# EAGLE design ctrlm_v1a (EAGLE 5.10)
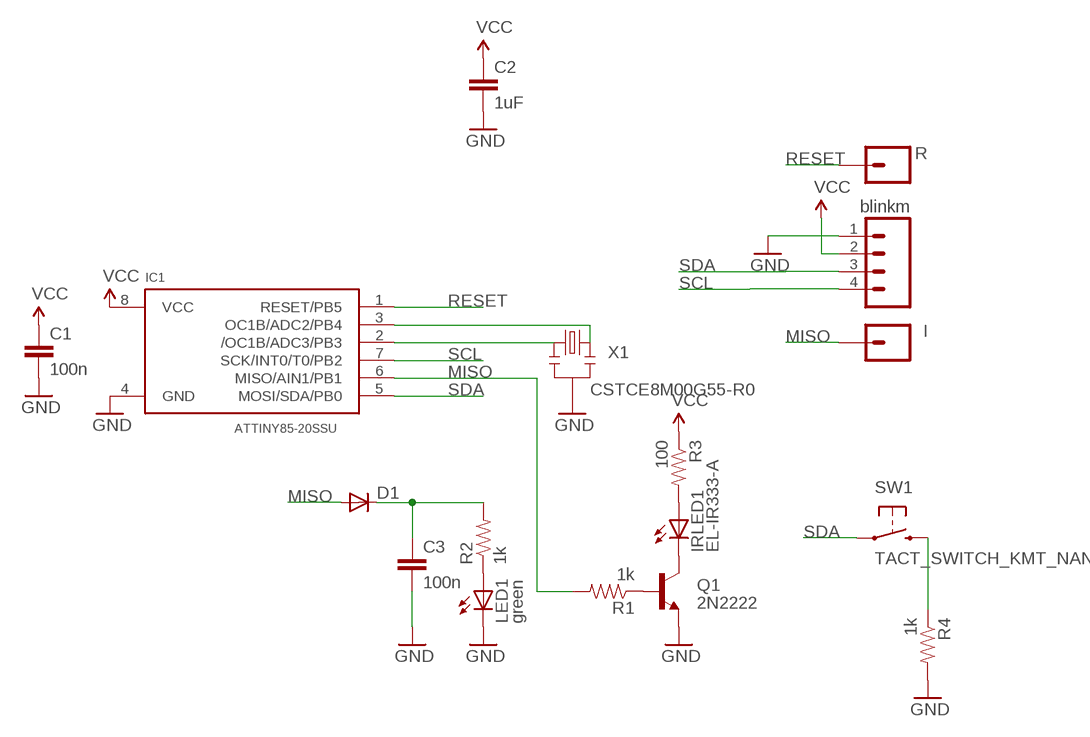
[diagram p0: schematic, sheet 1]

## Parts
C1  100n  CAP0603-CAP  [0603-CAP]
C2  1uF  CAP0805  [0805]
C3  100n  CAP0603-CAP  [0603-CAP]
D1  DIODESOD  [SOD-323]
I  M01PTH  [1X01]
IC1  ATTINY85-20SSU  ATTINY45SOIC  [SO08-EIAJ]
IRLED1  EL-IR333-A  LED5MM  [LED5MM]
JP1  blinkm  M04LOCK  [1X04_LOCK]
LED1  green  LED0603  [LED-0603]
Q1  2N2222  TRANSISTOR_NPNSOT23-3  [SOT23-3]
R  M01PTH  [1X01]
R1  1k  RESISTOR0603-RES  [0603-RES]
R2  1k  RESISTOR0603-RES  [0603-RES]
R3  100  RESISTOR0603-RES  [0603-RES]
R4  1k  RESISTOR0603-RES  [0603-RES]
SW1  TACT_SWITCH_KMT_NANO  [TACT_SWITCH_KMT_NANO]
X1  CSTCE8M00G55-R0  RESONATORSMD  [RESONATOR-SMD]

## Nets
GND: C1.2 C2.2 C3.2 IC1.4(GND) JP1.1 LED1.C Q1.2(E) R4.2 X1.2
MISO: D1.2(A) I.1 IC1.6(MISO/AIN1/PB1) R1.2
N$1: LED1.A R2.1
N$2: Q1.1(B) R1.1
N$3: IRLED1.K(C) Q1.3(C)
N$4: IC1.2(/OC1B/ADC3/PB3) X1.1
N$5: IC1.3(OC1B/ADC2/PB4) X1.3
N$6: C3.1 D1.1(C) R2.2
N$7: IRLED1.A R3.2
N$8: R4.1 SW1.P2@1
RESET: IC1.1(RESET/PB5) R.1
SCL: IC1.7(SCK/INT0/T0/PB2) JP1.4
SDA: IC1.5(MOSI/SDA/PB0) JP1.3 SW1.P1@1
VCC: C1.1 C2.1 IC1.8(VCC) JP1.2 R3.1

## Library data of the parts
C1-C3 = SparkFun-20091103:CAP: Capacitor Standard 0603 ceramic capacitor, and 0.1" leaded capacitor.
D1 = SparkFun-20091103:DIODE: Diode These are standard reverse protection diodes and small signal diodes. SMA package can handle up to about 1A. SOD-323 can handle about 200mA. What the SOD-323 package when ordering, there are some mfgs out there that are 5-pin packages.
I R = SparkFun-20091103:M01: Header 1 Standard 1-pin 0.1" header. Use with straight break away headers (SKU : PRT-00116), right angle break away headers (PRT-00553), swiss pins (PRT-00743), machine pins (PRT-00117), and female headers (PRT-00115).
IC1 = todstuff:ATTINY45
IRLED1 LED1 = SparkFun-20091103:LED: LEDs Standard schematic elements and footprints for 5mm, 3mm, 1206, and 0603 sized LEDs. 5mm - Spark Fun Electronics SKU : COM-00529 (and others)
JP1 = SparkFun-20091103:M04: Header 4 Standard 4-pin 0.1" header. Use with straight break away headers (SKU : PRT-00116), right angle break away headers (PRT-00553), swiss pins (PRT-00743), machine pins (PRT-00117), and female headers (PRT-00115). Molex polarized connector foot print use with SKU : PRT-08231 with associated crimp pins and housings.
Q1 = SparkFun-20091103:TRANSISTOR_NPN: Transistor NPN BJT configuration in SOT23 package. MMBT2222 is the common NPN we use. Double check BCE configuration again layout.
R1-R4 = SparkFun-20091103:RESISTOR: Resistor Basic schematic elements and footprints for 0603, 1206, and PTH 1/10th watt (small) resistors.
SW1 = todstuff:TACT_SWITCH_KMT_NANO
X1 = SparkFun-20090330:RESONATOR: Resonator Small SMD resonator. This is the itty bitty 10/20MHz resonators with built in caps. CSTCE10M0G55 and CSTCE20M0V53. Footprint has been reviewed closely but hasn't been tested yet.

## Board
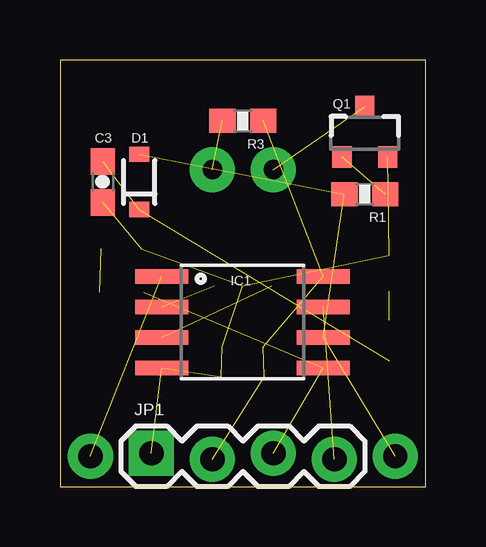
[diagram p1: board, top side]
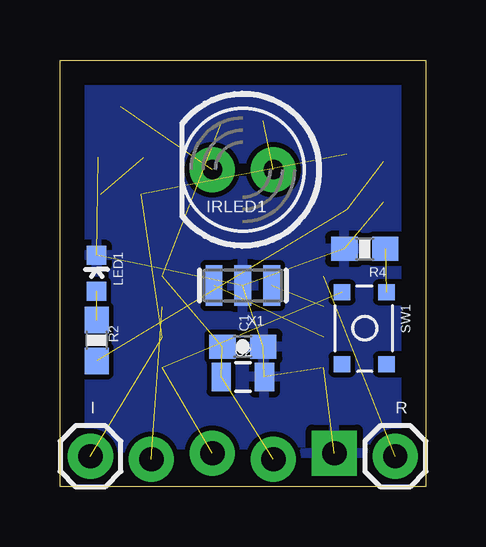
[diagram p2: board, bottom side, seen from below]

Size 15.24 x 17.78 mm. Coordinates in mm from the lower left corner, seen from the top.
Outline: 0,17.78 0,0 15.24,0 15.24,17.78 0,17.78
Copper layers (1*16): Top 0.035mm / dielectric 1.5mm / Bottom 0.035mm
Design rules "default": minimum track width 10mil, minimum drill 24mil, track to track 8mil, track to pad 8mil, pad to pad 8mil, via to via 8mil, smd to smd 8mil, copper to edge 40mil, drill to drill 8mil, minimum pad ring 10mil, minimum via ring 8mil, stop-mask expansion 4mil, vias tented up to drill 0mil, thermal gap 10mil

### Footprints (pad centres in the part's own frame; a part is rotated, then mirrored left to right if it is on the bottom)
0603-CAP = smd 1.1 x 1: 1 -0.85,0; 2 0.85,0
0805 = smd 0.8 x 1.2: 1 -0.9,0; 2 0.9,0
SOD-323 = smd 0.63 x 0.83: 1 -1.15,0; 2 1.15,0
1X01 = drill 1.016 pad 1.88 round: 1 0,0
SO08-EIAJ = smd 0.61 x 2.21: 1 -1.905,-3.378; 2 -0.635,-3.378; 3 0.635,-3.378; 4 1.905,-3.378; 5 1.905,3.353; 6 0.635,3.353; 7 -0.635,3.353; 8 -1.905,3.353
LED5MM = drill 0.813 pad 1.88 round: A -1.27,0; K 1.27,0
1X04_LOCK = drill 1.016 pad 1.88 square: 1 0,0.127 | drill 1.016 pad 1.88 round: 2 2.54,-0.127; 3 5.08,0.127; 4 7.62,-0.127
LED-0603 = smd 0.8 x 0.8: A 0,-0.75; C 0,0.75
SOT23-3 = smd 0.8 x 0.9: 1 -0.95,-1; 2 0.95,-1; 3 0,1.1
0603-RES = smd 1.1 x 1: 1 -0.85,0; 2 0.85,0
TACT_SWITCH_KMT_NANO = smd 0.65 x 0.7: P1@1 -1.5,-0.95; P1@2 1.5,-0.95; P2@1 -1.5,0.9; P2@2 1.5,0.9
RESONATOR-SMD = smd 0.7 x 1.7: 1 -1.2,0; 2 0,0; 3 1.2,0

### Placement (x,y rotation side)
C1  7.62,5.84 0 bottom
C2  7.62,4.57 0 bottom
C3  1.78,12.7 270 top
D1  3.3,12.7 90 top
I  13.97,1.27 0 bottom
IC1  7.62,6.86 270 top
IRLED1  7.62,13.21 180 bottom
JP1  3.81,1.27 0 top
LED1  13.72,8.89 0 bottom
Q1  12.7,14.73 0 top
R  1.27,1.27 0 bottom
R1  12.7,12.19 180 top
R2  13.72,6.1 270 bottom
R3  7.62,15.24 180 top
R4  2.54,9.91 180 bottom
SW1  2.54,6.6 270 bottom
X1  7.62,8.38 180 bottom

### Tracks (layer width: path | path; a pad name or v marks a point on that pad's centre or on a via)
GND  (8 unrouted)
  pour Bottom: 0,17.78 27.94,17.78 27.94,-1.27 0,-1.27
MISO  (3 unrouted)
N$1  (1 unrouted)
N$2  (1 unrouted)
N$3  (1 unrouted)
N$4  (1 unrouted)
N$5  (1 unrouted)
N$6  (2 unrouted)
N$7  (1 unrouted)
N$8  (1 unrouted)
RESET  (1 unrouted)
SCL  (1 unrouted)
SDA  (2 unrouted)
VCC  (4 unrouted)

### Text on the board
tPlace: freem_v1
bPlace: CtrlM | BlinkM | 20100701 | IR Control